# Altium schematic sheet Fsociety_Keyboard_SCH_Main.SchDoc: NEW DESIGN
size A2; CompanyName: Rena Electronica; Engineer: IK; Organization: Rena Electronica; Address1: de Ambachten 12; Address2: 4881 XZ; Address3: Zundert; Address4: the Netherlands; DocumentNumber: 05.xxx; Revision: 0.10; Customer: Klantnaam; PageSetup: Record=PageOptions|CenterHorizontal=True|CenterVertical=True|PrintScale=0.73|XCorrection=1.00|YCorrection=1.00|PrintKind=0|BorderSize=5000000|LeftOffset=0|BottomOffset=0|Orientation=2|PaperLength=1000|PaperWidth=1000|Scale=100|PaperSource=7|PrintQuality=-3|MediaType=1|DitherType=10|PrintScaleMode=1|PaperKind=A3|PaperIndex=8; ProjectName: R_NAAM.PRJ
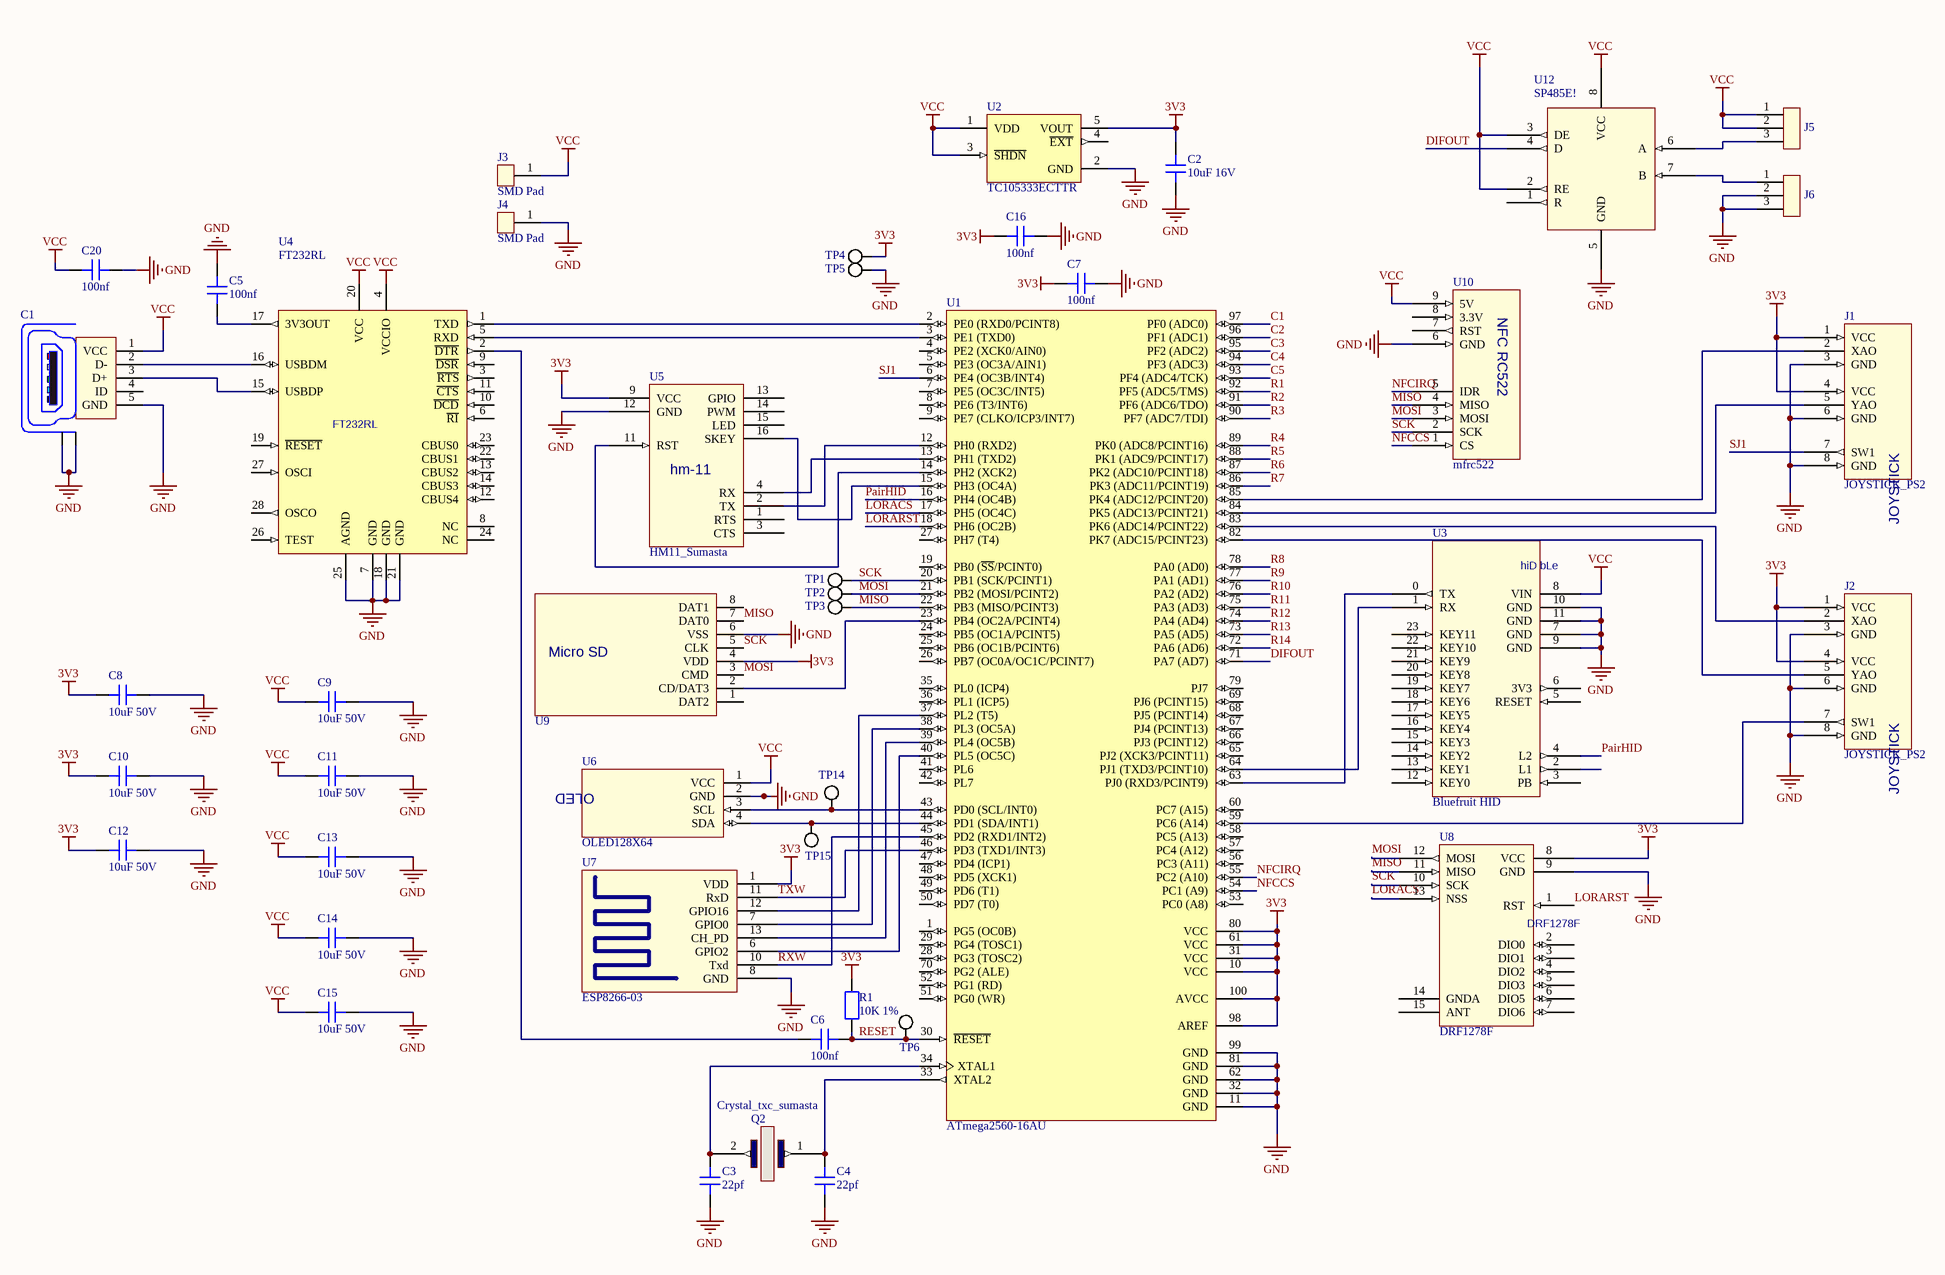
[diagram p0: Fsociety_Keyboard_SCH_Main.SchDoc]

## Parts
C1  WR-Communication Connectors 629105150921  [629105150921]  (value not drawn)
C2  10uF 16V  [CAPC1608X08_NR]
C3  22pf  [CAPC1608X08_NR]
C4  22pf  [CAPC1608X08_NR]
C5  100nf  [CAPC1608X08_NR]
C6  100nf  [CAPC1608X08_NR]
C7  100nf  [CAPC1608X08_NR]
C8  10uF 50V  [CAPC3216X09_MW]
C9  10uF 50V  [CAPC3216X09_MW]
C10  10uF 50V  [CAPC3216X09_MW]
C11  10uF 50V  [CAPC3216X09_MW]
C12  10uF 50V  [CAPC3216X09_MW]
C13  10uF 50V  [CAPC3216X09_MW]
C14  10uF 50V  [CAPC3216X09_MW]
C15  10uF 50V  [CAPC3216X09_MW]
C16  100nf  [CAPC1608X08_NR]
C20  100nf  [CAPC1608X08_NR]
J1  JOYSTICK_PS2  [JOYSTICK]
J2  JOYSTICK_PS2  [JOYSTICK]
J3  SMD Pad  [CON_SMDPAD_10X5]  (no BOM)
J4  SMD Pad  [CON_SMDPAD_10X5]  (no BOM)
J5  BB02-HA031-KB1-100/33/D1  [FCI_77315-134-03LF]  (value not drawn)
J6  BB02-HA031-KB1-100/33/D1  [FCI_77315-134-03LF]  (value not drawn)
Q2  Crystal_txc_sumasta  [Crystal_txc_sumasta]
R1  10K 1%  [RESC1608X06_NR]
TP1  TP  [TESTPAD-2MM]  (value not drawn)  (no BOM)
TP2  TP  [TESTPAD-2MM]  (value not drawn)  (no BOM)
TP3  TP  [TESTPAD-2MM]  (value not drawn)  (no BOM)
TP4  TP  [TESTPAD-2MM]  (value not drawn)  (no BOM)
TP5  TP  [TESTPAD-2MM]  (value not drawn)  (no BOM)
TP6  TP  [TESTPAD-2MM]  (value not drawn)  (no BOM)
TP14  TP  [TESTPAD-2MM]  (value not drawn)  (no BOM)
TP15  TP  [TESTPAD-2MM]  (value not drawn)  (no BOM)
U1  ATmega2560-16AU  [100A_N]
U2  TC105333ECTTR  [SOT-23-CT5_N]
U3  Bluefruit HID  [BLuefruit HID]
U4  FT232RL  [SSPO28]
U5  HM11_Sumasta  [HM11_Sumasta]
U6  OLED128X64  [OLED128x64]
U7  ESP8266-03  [ESP8266-03]
U8  DRF1278F  [DRF1278F]
U9  Micro SD Connector - Hinge  [Micro SD Socket]  (value not drawn)
U10  mfrc522  [MFRC522]
U12  MAXPartNumber: SP485E!  [SOIC127P600-8N]  (hidden comment: RS485 Buffer Transceiver)

## Nets
3V3: C2.2 C7.1 C8.1 C10.1 C12.1 C16.1 J1.1(VCC) J1.4(VCC) J2.1(VCC) J2.4(VCC) R1.2 TP4.1 U1.10(VCC) U1.31(VCC) U1.61(VCC) U1.80(VCC) U1.98(AREF) U1.100(AVCC) U2.5(VOUT) U5.9(VCC) U7.1(VDD) U8.8(VCC) U9.4(VDD)
GND: C1.5(GND) C1.Z1(Shield) C1.Z2(Shield) C2.1 C3.1 C4.1 C5.2 C7.2 C8.2 C9.2 C10.2 C11.2 C12.2 C13.2 C14.2 C15.2 C16.2 C20.1 J1.3(GND) J1.6(GND) J1.8(GND) J2.3(GND) J2.6(GND) J2.8(GND) J4.1 J6.2 J6.3 TP5.1 U1.11(GND) U1.32(GND) U1.62(GND) U1.81(GND) U1.99(GND) U2.2(GND) U3.7(GND) U3.9(GND) U3.10(GND) U3.11(GND) U4.7(GND) U4.18(GND) U4.21(GND) U4.25(AGND) U5.12(GND) U6.2(GND) U7.8(GND) U8.9(GND) U9.6(VSS) U10.6(GND) U12.5(GND)
VCC: C1.1(VCC) C9.1 C11.1 C13.1 C14.1 C15.1 C20.2 J3.1 J5.1 J5.2 U2.1(VDD) U2.3(~{SHDN}) U3.8(VIN) U4.4(VCCIO) U4.20(VCC) U6.1(VCC) U10.9(5V) U12.2(RE) U12.3(DE) U12.8(VCC)
C1: U1.97(PF0_(ADC0))
C2: U1.96(PF1_(ADC1))
C3: U1.95(PF2_(ADC2))
C4: U1.94(PF3_(ADC3))
C5: U1.93(PF4_(ADC4/TCK))
DIFOUT: U1.71(PA7_(AD7)) U12.4(D)
LORACS: U1.17(PH5_(OC4C)) U8.13(NSS)
LORARST: U1.18(PH6_(OC2B)) U8.1(RST)
MISO: TP3.1 U1.22(PB3_(MISO/PCINT3)) U8.11(MISO) U9.7(DAT0) U10.4(MISO)
MOSI: TP2.1 U1.21(PB2_(MOSI/PCINT2)) U8.12(MOSI) U9.3(CMD) U10.3(MOSI)
NFCCS: U1.54(PC1_(A9)) U10.1(CS)
NFCIRQ: U1.55(PC2_(A10)) U10.5(IDR)
PairHID: U1.16(PH4_(OC4B)) U3.4(L2)
R1: U1.92(PF5_(ADC5/TMS))
R2: U1.91(PF6_(ADC6/TDO))
R3: U1.90(PF7_(ADC7/TDI))
R4: U1.89(PK0_(ADC8/PCINT16))
R5: U1.88(PK1_(ADC9/PCINT17))
R6: U1.87(PK2_(ADC10/PCINT18))
R7: U1.86(PK3_(ADC11/PCINT19))
R8: U1.78(PA0_(AD0))
R9: U1.77(PA1_(AD1))
R10: U1.76(PA2_(AD2))
R11: U1.75(PA3_(AD3))
R12: U1.74(PA4_(AD4))
R13: U1.73(PA5_(AD5))
R14: U1.72(PA6_(AD6))
RESET: C6.2 R1.1 TP6.1 U1.30(~{RESET})
RXW: U1.45(PD2_(RXD1/INT2)) U7.10(Txd)
SCK: TP1.1 U1.20(PB1_(SCK/PCINT1)) U8.10(SCK) U9.5(CLK) U10.2(SCK)
SJ1: J1.7(SW1) U1.6(PE4_(OC3B/INT4))
TXW: U1.46(PD3_(TXD1/INT3)) U7.11(RxD)
NetC1_2: C1.2(D-) U4.16(USBDM)
NetC1_3: C1.3(D+) U4.15(USBDP)
NetC3_2: C3.2 Q2.2 U1.34(XTAL1)
NetC4_2: C4.2 Q2.1 U1.33(XTAL2)
NetC5_1: C5.1 U4.17(3V3OUT)
NetC6_1: C6.1 U4.2(~{DTR})
NetJ1_2: J1.2(XAO) U1.85(PK4_(ADC12/PCINT20))
NetJ1_5: J1.5(YAO) U1.84(PK5_(ADC13/PCINT21))
NetJ2_2: J2.2(XAO) U1.83(PK6_(ADC14/PCINT22))
NetJ2_5: J2.5(YAO) U1.82(PK7_(ADC15/PCINT23))
NetJ2_7: J2.7(SW1) U1.59(PC6_(A14))
NetJ5_3: J5.3 U12.6(A)
NetJ6_1: J6.1 U12.7(B)
NetTP14_1: TP14.1 U1.43(PD0_(SCL/INT0)) U6.3(SCL)
NetTP15_1: TP15.1 U1.44(PD1_(SDA/INT1)) U6.4(SDA)
NetU1_2: U1.2(PE0_(RXD0/PCINT8)) U4.1(TXD)
NetU1_3: U1.3(PE1_(TXD0)) U4.5(RXD)
NetU1_12: U1.12(PH0_(RXD2)) U5.2(TX)
NetU1_13: U1.13(PH1_(TXD2)) U5.4(RX)
NetU1_14: U1.14(PH2_(XCK2)) U5.11(RST)
NetU1_15: U1.15(PH3_(OC4A)) U5.16(SKEY)
NetU1_23: U1.23(PB4_(OC2A/PCINT4)) U9.2(CD/DAT3)
NetU1_37: U1.37(PL2_(T5)) U7.12(GPIO16)
NetU1_38: U1.38(PL3_(OC5A)) U7.7(GPIO0)
NetU1_39: U1.39(PL4_(OC5B)) U7.13(CH_PD)
NetU1_40: U1.40(PL5_(OC5C)) U7.6(GPIO2)
NetU1_63: U1.63(PJ0_(RXD3/PCINT9)) U3.0(TX)
NetU1_64: U1.64(PJ1_(TXD3/PCINT10)) U3.1(RX)

Not connected (* = marked no-connect by the designer): C1 4(ID); U1 1(PG5_(OC0B)) 4(PE2_(XCK0/AIN0)) 5(PE3_(OC3A/AIN1)) 7(PE5_(OC3C/INT5)) 8(PE6_(T3/INT6)) 9(PE7_(CLKO/ICP3/INT7)) 19(PB0_(~{SS}/PCINT0)) 24(PB5_(OC1A/PCINT5)) 25(PB6_(OC1B/PCINT6)) 26(PB7_(OC0A/OC1C/PCINT7)) 27(PH7_(T4)) 28(PG3_(TOSC2)) 29(PG4_(TOSC1)) 35(PL0_(ICP4)) 36(PL1_(ICP5)) 41(PL6) 42(PL7) 47(PD4_(ICP1)) 48(PD5_(XCK1)) 49(PD6_(T1)) 50(PD7_(T0)) 51(PG0_(WR)) 52(PG1_(RD)) 53(PC0_(A8)) 56(PC3_(A11)) 57(PC4_(A12)) 58(PC5_(A13)) 60(PC7_(A15)) 65(PJ2_(XCK3/PCINT11)) 66(PJ3_(PCINT12)) 67(PJ4_(PCINT13)) 68(PJ5_(PCINT14)) 69(PJ6_(PCINT15)) 70(PG2_(ALE)) 79(PJ7); U2 4(~{EXT}); U3 2(L1) 3(PB) 5(RESET) 6(3V3) 12(KEY0) 13(KEY1) 14(KEY2) 15(KEY3) 16(KEY4) 17(KEY5) 18(KEY6) 19(KEY7) 20(KEY8) 21(KEY9) 22(KEY10) 23(KEY11); U4 3(~{RTS}) 6(~{RI}) 8(NC) 9(~{DSR}) 10(~{DCD}) 11(~{CTS}) 12(CBUS4) 13(CBUS2) 14(CBUS3) 19(~{RESET}) 22(CBUS1) 23(CBUS0) 24(NC) 26(TEST) 27(OSCI) 28(OSCO); U5 1(RTS) 3(CTS) 13(GPIO) 14(PWM) 15(LED); U8 2(DIO0) 3(DIO1) 4(DIO2) 5(DIO3) 6(DIO5) 7(DIO6) 14(GNDA) 15(ANT); U9 1(DAT2) 8(DAT1); U10 7(RST) 8(3.3V); U12 1(R)

## Notes on the sheet
- (in symbol Bluefruit HID) hiD bLe
- (in symbol HM11_Sumasta) hm-11
- (in symbol JOYSTICK_PS2) JOYSTICK
- (in symbol mfrc522) NFC RC522
- (in symbol MicroSD Socket) Micro SD
- (in symbol OLED128X64) OLED

## Library data of the parts
C1 = WR-Communication Connectors 629105150921: WR-COM_USB_Micro Type AB_Horizontal_SMT; Manufacturer: Würth Elektronik eiSos GmbH; ComponentLink1 Description: Manufacturer; ComponentLink2 Description: Datasheet; NoPins: 5; ComponentLink1URL: http://www.we-online.de; ComponentLink2URL: http://katalog.we-online.de/em/datasheet/629105150921.pdf; Created by: Karrer Zheng; Created Date: 10/23/2014; partNo: 629105150921
C2-C7 C16 C20 = CMP-00064-A.5: Capacitor 10nF X7R ±10% 50V 0603(1608) SMD; MAXPartNumber: 10N/50-0603!; Case-EIA: 0603; Case-Metric: 1608; Value: 10nF; Dielectric Characteristic: X7R; Thickness (max): 0.9mm; Tolerance: ±10%; Voltage: 50V
C8-C15 = CMP-01312-A.1: Capacitor 10uF X5R ±20% 50V 1206(3216) SMD; MAXPartNumber: 10U/50!; Case-Metric: 3216; Case-EIA: 1206; Value: 10uF; Thickness (max): 1.8mm; Voltage: 50V; Tolerance: ±20%; Dielectric Characteristic: X5R
J3 J4 = CMP-00667-A.10: SMD PAD DIFFERENT SHAPES; MAXPartNumber: PAD_SMD!#; FLS_PN: PAD_SMD!#; RENA_PN: PAD_SMD!#
J5 J6 = CMP-01396-A.1: Unshrouded header 3-pin right angle; FLS_PN: CON-BB02-HA031; RENA_PN: CON-BB02-HA031; MAXPartNumber: CON-BB02-HA031
R1 = CMP-00060-A.4: 10K  0.1W 1% 0603(1608 Metric) SMD; MaxPartNumber: 10K-0603!; Case-EIA: 0603; Case-Metric: 1608; Value: 10K Ohm; Power: 0.1W; Technology: SMT; Tolerance: 1%; FLS_PN: 10K-0603!; RENA_PN: 10K-0603!
TP1-TP6 TP14 TP15 = CMP-00759-A.11: TESTPOINT; FLS_PN: TP#; RENA_PN: TP#; MAXPartNumber: TP#; ComponentLink1Description: Manufacturer URL; ComponentLink2Description: Datasheet; ComponentLink3Description: Package Specification
U1 = ATmega2560-16AU: 8-bit AVR Microcontroller, 4.5-5.5V, 16MHz, 256KB Flash, 4KB EEPROM, 8KB SRAM, 86 GPIO pins, 100-pin TQFP, Industrial Grade (-40°C to 85°C), Pb-Free; DatasheetVersion: revN, May-2011; PackageVersion: revD, Oct-2010; PackageReference: 100A; PackageDescription: 100-Pin Thin Profile Plastic Quad Flat Pack (TQFP), 14 x 14 x 1.0 mm Body, 0.5 mm Pitch; Code_JEDEC: MS-026-AED; ComponentLink1Description: Manufacturer URL; ComponentLink1URL: http://www.atmel.com/; ComponentLink2Description: ATmega640/1280/1281/2560/2561 Datasheet; ComponentLink2URL: http://www.atmel.com/dyn/resources/prod_documents/doc2549.pdf; ComponentLink3Description: ATmega640/1280/1281/2560/2561 Summary; ComponentLink3URL: http://www.atmel.com/dyn/resources/prod_documents/2549S.pdf
U2 = TC105333ECTTR: PFM/PWM Step-Down DC/DC Controller, 1A, 3.3V, 300kHz, 5-Pin SOT-23, Industrial Temperature, Tape and Reel; Manufacturer: Microchip; DatasheetVersion: revB, Feb-2003; PackageVersion: revBB, Aug-2009; PackageReference: SOT-23-CT5; PackageDescription: 5-Lead Plastic Small Outline Transistor (CT) [SOT-23]; Supplier 1: Digi-Key; Supplier Part Number 1: TC105333ECTTR-ND; Supplier 2: Newark; Supplier Part Number 2: 92C5570; Supplier 3: Mouser; Supplier Part Number 3: 579-TC105333ECTTR; Mounting Technology: Surface Mount; Code_IPC: SOT23-5; PartNumber: TC105333ECTTR; ComponentLink1Description: Manufacturer URL; ComponentLink1URL: http://www.microchip.com/; ComponentLink2Description: Datasheet; ComponentLink2URL: http://ww1.microchip.com/downloads/en/DeviceDoc/21349b.pdf; ComponentLink3Description: Package Specification; ComponentLink3URL: http://www.microchip.com/stellent/groups/techpub_sg/documents/packagingspec/en012702.pdf
U9 = MicroSD Socket
U12 = SN75176: PartnumMAX: SP485E!